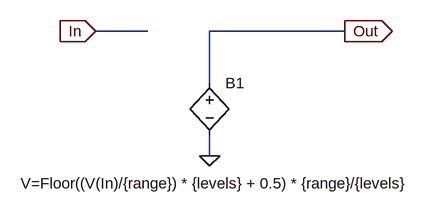
[diagram p0: schematic Quantize.asc]
Quantize.asc, the LTspice schematic file:
Version 4
SHEET 1 948 680
WIRE 144 96 64 96
WIRE 448 96 240 96
WIRE 240 176 240 96
WIRE 240 288 240 256
FLAG 64 96 In
IOPIN 64 96 In
FLAG 240 288 0
FLAG 448 96 Out
IOPIN 448 96 Out
SYMBOL bv 240 160 R0
WINDOW 3 -291 171 Left 0
SYMATTR Value V=Floor((V(In)/{range}) * {levels} + 0.5) * {range}/{levels}
SYMATTR InstName B1

The netlist it stands for:
* Quantize.asc
B1 Out 0 V=Floor((V(In)/{range}) * {levels} + 0.5) * {range}/{levels}
.backanno
.end